# Altium project air-esp8266.PrjPcb
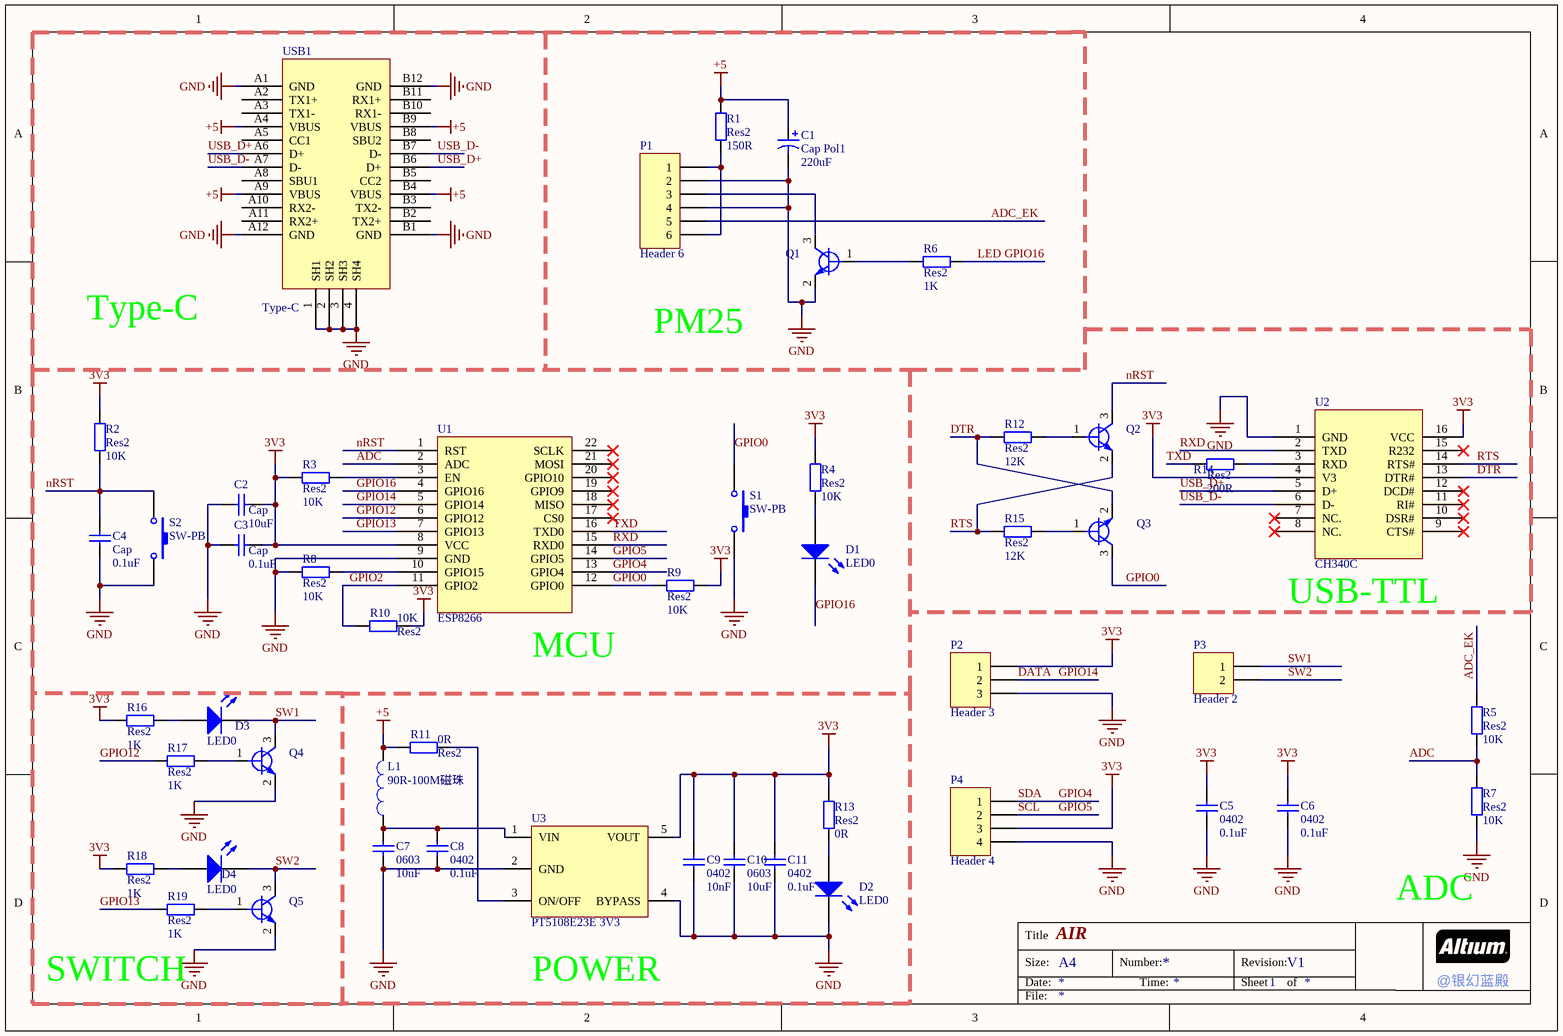
[diagram p0: Sheet1.SchDoc]
1 sheet, 50 parts. Net scope: global (net labels, ports and power ports of the same name join across sheets).
Board file: PCB1.PcbDoc

## Sheet Sheet1.SchDoc: AIR
size A4; Author: YHLD; DrawnBy: YHLD; Revision: V1; SheetNumber: 1

### Parts
C1  Cap Pol1  value 220uF  [CAP 2.5*6.3*11.2]
C2  Cap  value 10uF  [C 0402_M]
C3  Cap  value 0.1uF  [C 0402_M]
C4  Cap  value 0.1uF  [C 0402_M]
C5  0402  value 0.1uF  [C 0402_M]
C6  0402  value 0.1uF  [C 0402_M]
C7  0603  value 10uF  [C 0603_M]
C8  0402  value 0.1uF  [C 0402_M]
C9  0402  value 10nF  [C 0402_M]
C10  0603  value 10uF  [C 0603_M]
C11  0402  value 0.1uF  [C 0402_M]
D1  LED0  [LED 0603R]
D2  LED0  [LED 0603R]
D3  LED0  [LED 0603R]
D4  LED0  [LED 0603R]
L1  90R-100M磁珠  [R 0603_M]
P1  Header 6  [HDR1X6]
P2  Header 3  [HDR1X3]
P3  Header 2  [HDR1X2]
P4  Header 4  [HDR1X4]
Q1  Y1 NPN SOT23-3  [SMT_TRIODE_NPN]  (value not drawn)
Q2  Y1 NPN SOT23-3  [SMT_TRIODE_NPN]  (value not drawn)
Q3  Y1 NPN SOT23-3  [SMT_TRIODE_NPN]  (value not drawn)
Q4  Y1 NPN SOT23-3  [SMT_TRIODE_NPN]  (value not drawn)
Q5  Y1 NPN SOT23-3  [SMT_TRIODE_NPN]  (value not drawn)
R1  Res2  value 150R  [R 0402_M]
R2  Res2  value 10K  [R 0402_M]
R3  Res2  value 10K  [R 0402_M]
R4  Res2  value 10K  [R 0402_M]
R5  Res2  value 10K  [R 0402_M]
R6  Res2  value 1K  [R 0402_M]
R7  Res2  value 10K  [R 0402_M]
R8  Res2  value 10K  [R 0402_M]
R9  Res2  value 10K  [R 0402_M]
R10  Res2  value 10K  [R 0402_M]
R11  Res2  value 0R  [R 0402_M]
R12  Res2  value 12K  [R 0402_M]
R13  Res2  value 0R  [R 0402_M]
R14  Res2  value 200R  [R 0402_M]
R15  Res2  value 12K  [R 0402_M]
R16  Res2  value 1K  [R 0402_M]
R17  Res2  value 1K  [R 0402_M]
R18  Res2  value 1K  [R 0402_M]
R19  Res2  value 1K  [R 0402_M]
S1  SW-PB  [TSW DIP-6*6*5]
S2  SW-PB  [TSW DIP-6*6*5]
U1  ESP8266  [esp8266]
U2  CH340C  [CH340]
U3  PT5108E23E 3V3  [SOT23-5]
USB1  Type-C  [Type-C-TOP]

### Blocks framed on the sheet
SWITCH: D3 D4 Q4 Q5 R16-R19
POWER: C7-C11 D2 L1 R11 R13 U3

### Nets
3V3: C2.2 C3.2 C5.2 C6.2 C9.2 C10.2 C11.2 P2.1 P4.3 R2.1 R3.2 R4.1 R9.1 R10.1 R13.1 R16.1 R18.1 U1.8(VCC) U2.4(V3) U2.16(VCC) U3.5(VOUT)
+5: C1.1 L1.2 R1.2 R11.2 USB1.A4(VBUS) USB1.A9(VBUS) USB1.B4(VBUS) USB1.B9(VBUS)
GND: C1.2 C2.1 C3.1 C4.1 C5.1 C6.1 C7.1 C8.1 C9.1 C10.1 C11.1 D2.2(K) P1.2 P1.4 P2.3 P4.4 Q1.2(EMITTER) Q4.2(EMITTER) Q5.2(EMITTER) R7.2 R8.2 S1.2 S2.2 U1.9(GND) U2.1(GND) U3.2(GND) U3.4(BYPASS) USB1.1(SH1) USB1.2(SH2) USB1.3(SH3) USB1.4(SH4) USB1.A1(GND) USB1.A12(GND) USB1.B1(GND) USB1.B12(GND)
ADC: R5.2 R7.1 U1.2(ADC)
ADC_EK: P1.5 R5.1
DATA: P2.2 U1.5(GPIO14)  [also labelled GPIO14]
DTR: Q3.2(EMITTER) R12.1 U2.13(DTR#)
GPIO0: Q3.3(COLLECTOR) R9.2 S1.1 U1.12(GPIO0)
GPIO2: R10.2 U1.11(GPIO2)
GPIO4: P4.1 U1.13(GPIO4)  [also labelled SDA]
GPIO5: P4.2 U1.14(GPIO5)  [also labelled SCL]
GPIO12: R17.1 U1.6(GPIO12)
GPIO13: R19.1 U1.7(GPIO13)
GPIO16: D1.2(K) R6.2 U1.4(GPIO16)  [also labelled LED]
nRST: C4.2 Q2.3(COLLECTOR) R2.2 S2.1 U1.1(RST)
RTS: Q2.2(EMITTER) R15.1 U2.14(RTS#)
RXD: U1.15(RXD0) U2.2(TXD)
SW1: D3.2(K) P3.1 Q4.3(COLLECTOR)
SW2: D4.2(K) P3.2 Q5.3(COLLECTOR)
TXD: R14.1 U1.16(TXD0)
USB_D+: U2.5(D+) USB1.A6(D+) USB1.B6(D+)
USB_D-: U2.6(D-) USB1.A7(D-) USB1.B7(D-)
NetC7_2: C7.2 C8.2 L1.1 U3.1(VIN)
NetD1_1: D1.1(A) R4.2
NetD2_1: D2.1(A) R13.2
NetD3_1: D3.1(A) R16.2
NetD4_1: D4.1(A) R18.2
NetP1_1: P1.1 P1.6 R1.1
NetP1_3: P1.3 Q1.3(COLLECTOR)
NetQ1_1: Q1.1(BASE) R6.1
NetQ2_1: Q2.1(BASE) R12.2
NetQ3_1: Q3.1(BASE) R15.2
NetQ4_1: Q4.1(BASE) R17.2
NetQ5_1: Q5.1(BASE) R19.2
NetR3_1: R3.1 U1.3(EN)
NetR8_1: R8.1 U1.10(GPIO15)
NetR11_1: R11.1 U3.3(ON/OFF)
NetR14_2: R14.2 U2.3(RXD)

Not connected (* = marked no-connect by the designer): U1 17(CS0)* 18(MISO)* 19(GPIO9)* 20(GPIO10)* 21(MOSI)* 22(SCLK)*; U2 7(NC.)* 8(NC.)* 9(CTS#)* 10(DSR#)* 11(RI#)* 12(DCD#)* 15(R232)*; USB1 A2(TX1+) A3(TX1-) A5(CC1) A8(SBU1) A10(RX2-) A11(RX2+) B2(TX2+) B3(TX2-) B5(CC2) B8(SBU2) B10(RX1-) B11(RX1+)

### Notes on the sheet
- Type-C
- PM25
- (near U2) USB-TTL
- (near U1) MCU
- ADC
- Title
- Size:
- Date:
- A4
- Number:
- Time:
- Revision:
- Sheet
- of
- @银幻蓝殿
- File:

### Library data of the parts
C1 = Cap Pol1: Polarized Capacitor (Radial); Published: 8-Jun-2000; LatestRevisionDate: 17-Jul-2002; LatestRevisionNote: Re-released for DXP Platform.; PackageReference: RB7.6-15; Publisher: Altium Limited; PackageDescription: Polarized Capacitor (Radial); 2 Leads
C2-C4 = Cap: Capacitor; Published: 8-Jun-2000; LatestRevisionDate: 17-Jul-2002; LatestRevisionNote: Re-released for DXP Platform.; PackageReference: RAD-0.3; Publisher: Altium Limited; PackageDescription: Radial Cap, Thru-Hole; 2 Leads; 0.3 in Pin Spacing
C5-C11 = Cap Semi: Capacitor (Semiconductor SIM Model); Published: 8-Jun-2000; LatestRevisionDate: 29-May-2009; LatestRevisionNote: IPC-7351 Footprint Added.; PackageReference: C1206; Publisher: Altium Limited; PackageDescription: Chip Capacitor
D1-D4 = LED0: Typical INFRARED GaAs LED; Published: 8-Jun-2000; LatestRevisionDate: 08-Jul-2005; LatestRevisionNote: Mech Layer 1 removed.; PackageReference: LED-0; Publisher: Altium Limited; PackageDescription: LED; 2 Leads
L1 = L,10UH,1.7A,S5*5*4.7,0.093Ω_1: Vastdigital ID: ML0003 0025; PCB Footprint: 0805
P1 = Header 6: Header, 6-Pin; LatestRevisionDate: 17-Jul-2002; LatestRevisionNote: Re-released for DXP Platform.; Publisher: Altium Limited
P2 = Header 3: Header, 3-Pin; LatestRevisionDate: 17-Jul-2002; LatestRevisionNote: Re-released for DXP Platform.; Publisher: Altium Limited
P3 = Header 2: Header, 2-Pin; LatestRevisionDate: 17-Jul-2002; LatestRevisionNote: Re-released for DXP Platform.; Publisher: Altium Limited
P4 = Header 4: Header, 4-Pin; LatestRevisionDate: 17-Jul-2002; LatestRevisionNote: Re-released for DXP Platform.; Publisher: Altium Limited
Q1-Q5 = S8050
R1-R19 = Res2: Resistor; Published: 8-Jun-2000; LatestRevisionDate: 17-Jul-2002; LatestRevisionNote: Re-released for DXP Platform.; PackageReference: AXIAL-0.4; Publisher: Altium Limited; PackageDescription: Axial Device, Thru-Hole; 2 Leads; 0.4 in Pin Spacing
S1 S2 = SW-PB: Switch; Published: 24-Mar-1999; LatestRevisionDate: 17-Jul-2002; LatestRevisionNote: Re-released for DXP Platform.; PackageReference: SPST-2; Publisher: Altium Limited; PackageDescription: Switch; 2 Leads
U3 = LP2992: LDO
USB1 = USB-Type-C-TOP